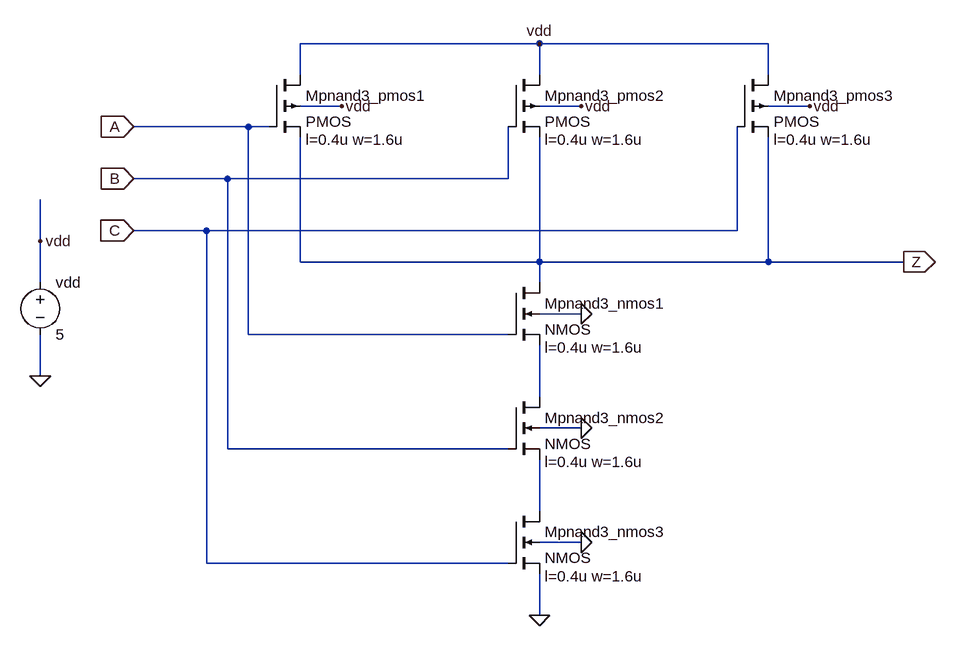
[diagram p0: schematic sram_16x2_pnand3_0.asc]
sram_16x2_pnand3_0.asc, the LTspice schematic file:
Version 4
SHEET 1 1192 1028
WIRE 560 128 192 128
WIRE 912 128 560 128
WIRE 192 176 192 128
WIRE 560 176 560 128
WIRE 912 176 912 128
WIRE 256 224 192 224
WIRE 624 224 560 224
WIRE 976 224 912 224
WIRE 112 256 -64 256
WIRE 144 256 112 256
WIRE 80 336 -64 336
WIRE 512 336 512 256
WIRE 512 336 80 336
WIRE 48 416 -64 416
WIRE 864 416 864 256
WIRE 864 416 48 416
WIRE -208 432 -208 368
WIRE 192 464 192 272
WIRE 560 464 560 272
WIRE 560 464 192 464
WIRE 912 464 912 272
WIRE 912 464 560 464
WIRE 1120 464 912 464
WIRE -208 496 -208 432
WIRE 560 496 560 464
WIRE 624 544 560 544
WIRE 112 576 112 256
WIRE 512 576 112 576
WIRE -208 640 -208 576
WIRE 560 672 560 592
WIRE 624 720 560 720
WIRE 80 752 80 336
WIRE 512 752 80 752
WIRE 560 848 560 768
WIRE 624 896 560 896
WIRE 48 928 48 416
WIRE 512 928 48 928
WIRE 560 1008 560 944
FLAG -64 256 A
IOPIN -64 256 In
FLAG -64 336 B
IOPIN -64 336 In
FLAG -64 416 C
IOPIN -64 416 In
FLAG 1120 464 Z
IOPIN 1120 464 Out
FLAG -208 640 0
FLAG 624 544 0
FLAG 624 720 0
FLAG 624 896 0
FLAG -208 432 vdd
FLAG 256 224 vdd
FLAG 624 224 vdd
FLAG 976 224 vdd
FLAG 560 1008 0
FLAG 560 128 vdd
SYMBOL pmos4 144 176 R0
WINDOW 123 56 100 Left 2
SYMATTR InstName Mpnand3_pmos1
SYMATTR Value2 l=0.4u w=1.6u
SYMBOL pmos4 512 176 R0
WINDOW 123 56 100 Left 2
SYMATTR InstName Mpnand3_pmos2
SYMATTR Value2 l=0.4u w=1.6u
SYMBOL pmos4 864 176 R0
WINDOW 123 56 100 Left 2
SYMATTR InstName Mpnand3_pmos3
SYMATTR Value2 l=0.4u w=1.6u
SYMBOL nmos4 512 496 R0
WINDOW 123 56 100 Left 2
SYMATTR InstName Mpnand3_nmos1
SYMATTR Value2 l=0.4u w=1.6u
SYMBOL nmos4 512 672 R0
WINDOW 123 56 100 Left 2
SYMATTR InstName Mpnand3_nmos2
SYMATTR Value2 l=0.4u w=1.6u
SYMBOL nmos4 512 848 R0
WINDOW 123 56 100 Left 2
SYMATTR InstName Mpnand3_nmos3
SYMATTR Value2 l=0.4u w=1.6u
SYMBOL voltage -208 480 R0
WINDOW 123 0 0 Left 0
WINDOW 39 0 0 Left 0
SYMATTR InstName vdd
SYMATTR Value 5

The netlist it stands for:
* sram_16x2_pnand3_0.asc
Mpnand3_pmos1 vdd A Z vdd PMOS l=0.4u w=1.6u
Mpnand3_pmos2 vdd B Z vdd PMOS l=0.4u w=1.6u
Mpnand3_pmos3 vdd C Z vdd PMOS l=0.4u w=1.6u
Mpnand3_nmos1 Z A N001 0 NMOS l=0.4u w=1.6u
Mpnand3_nmos2 N001 B N002 0 NMOS l=0.4u w=1.6u
Mpnand3_nmos3 N002 C 0 0 NMOS l=0.4u w=1.6u
vdd vdd 0 5
.model NMOS NMOS
.model PMOS PMOS
.lib standard.mos
.backanno
.end